# Altium schematic sheet Power.SchDoc
size C; SheetNumber: 3; SheetTotal: 6
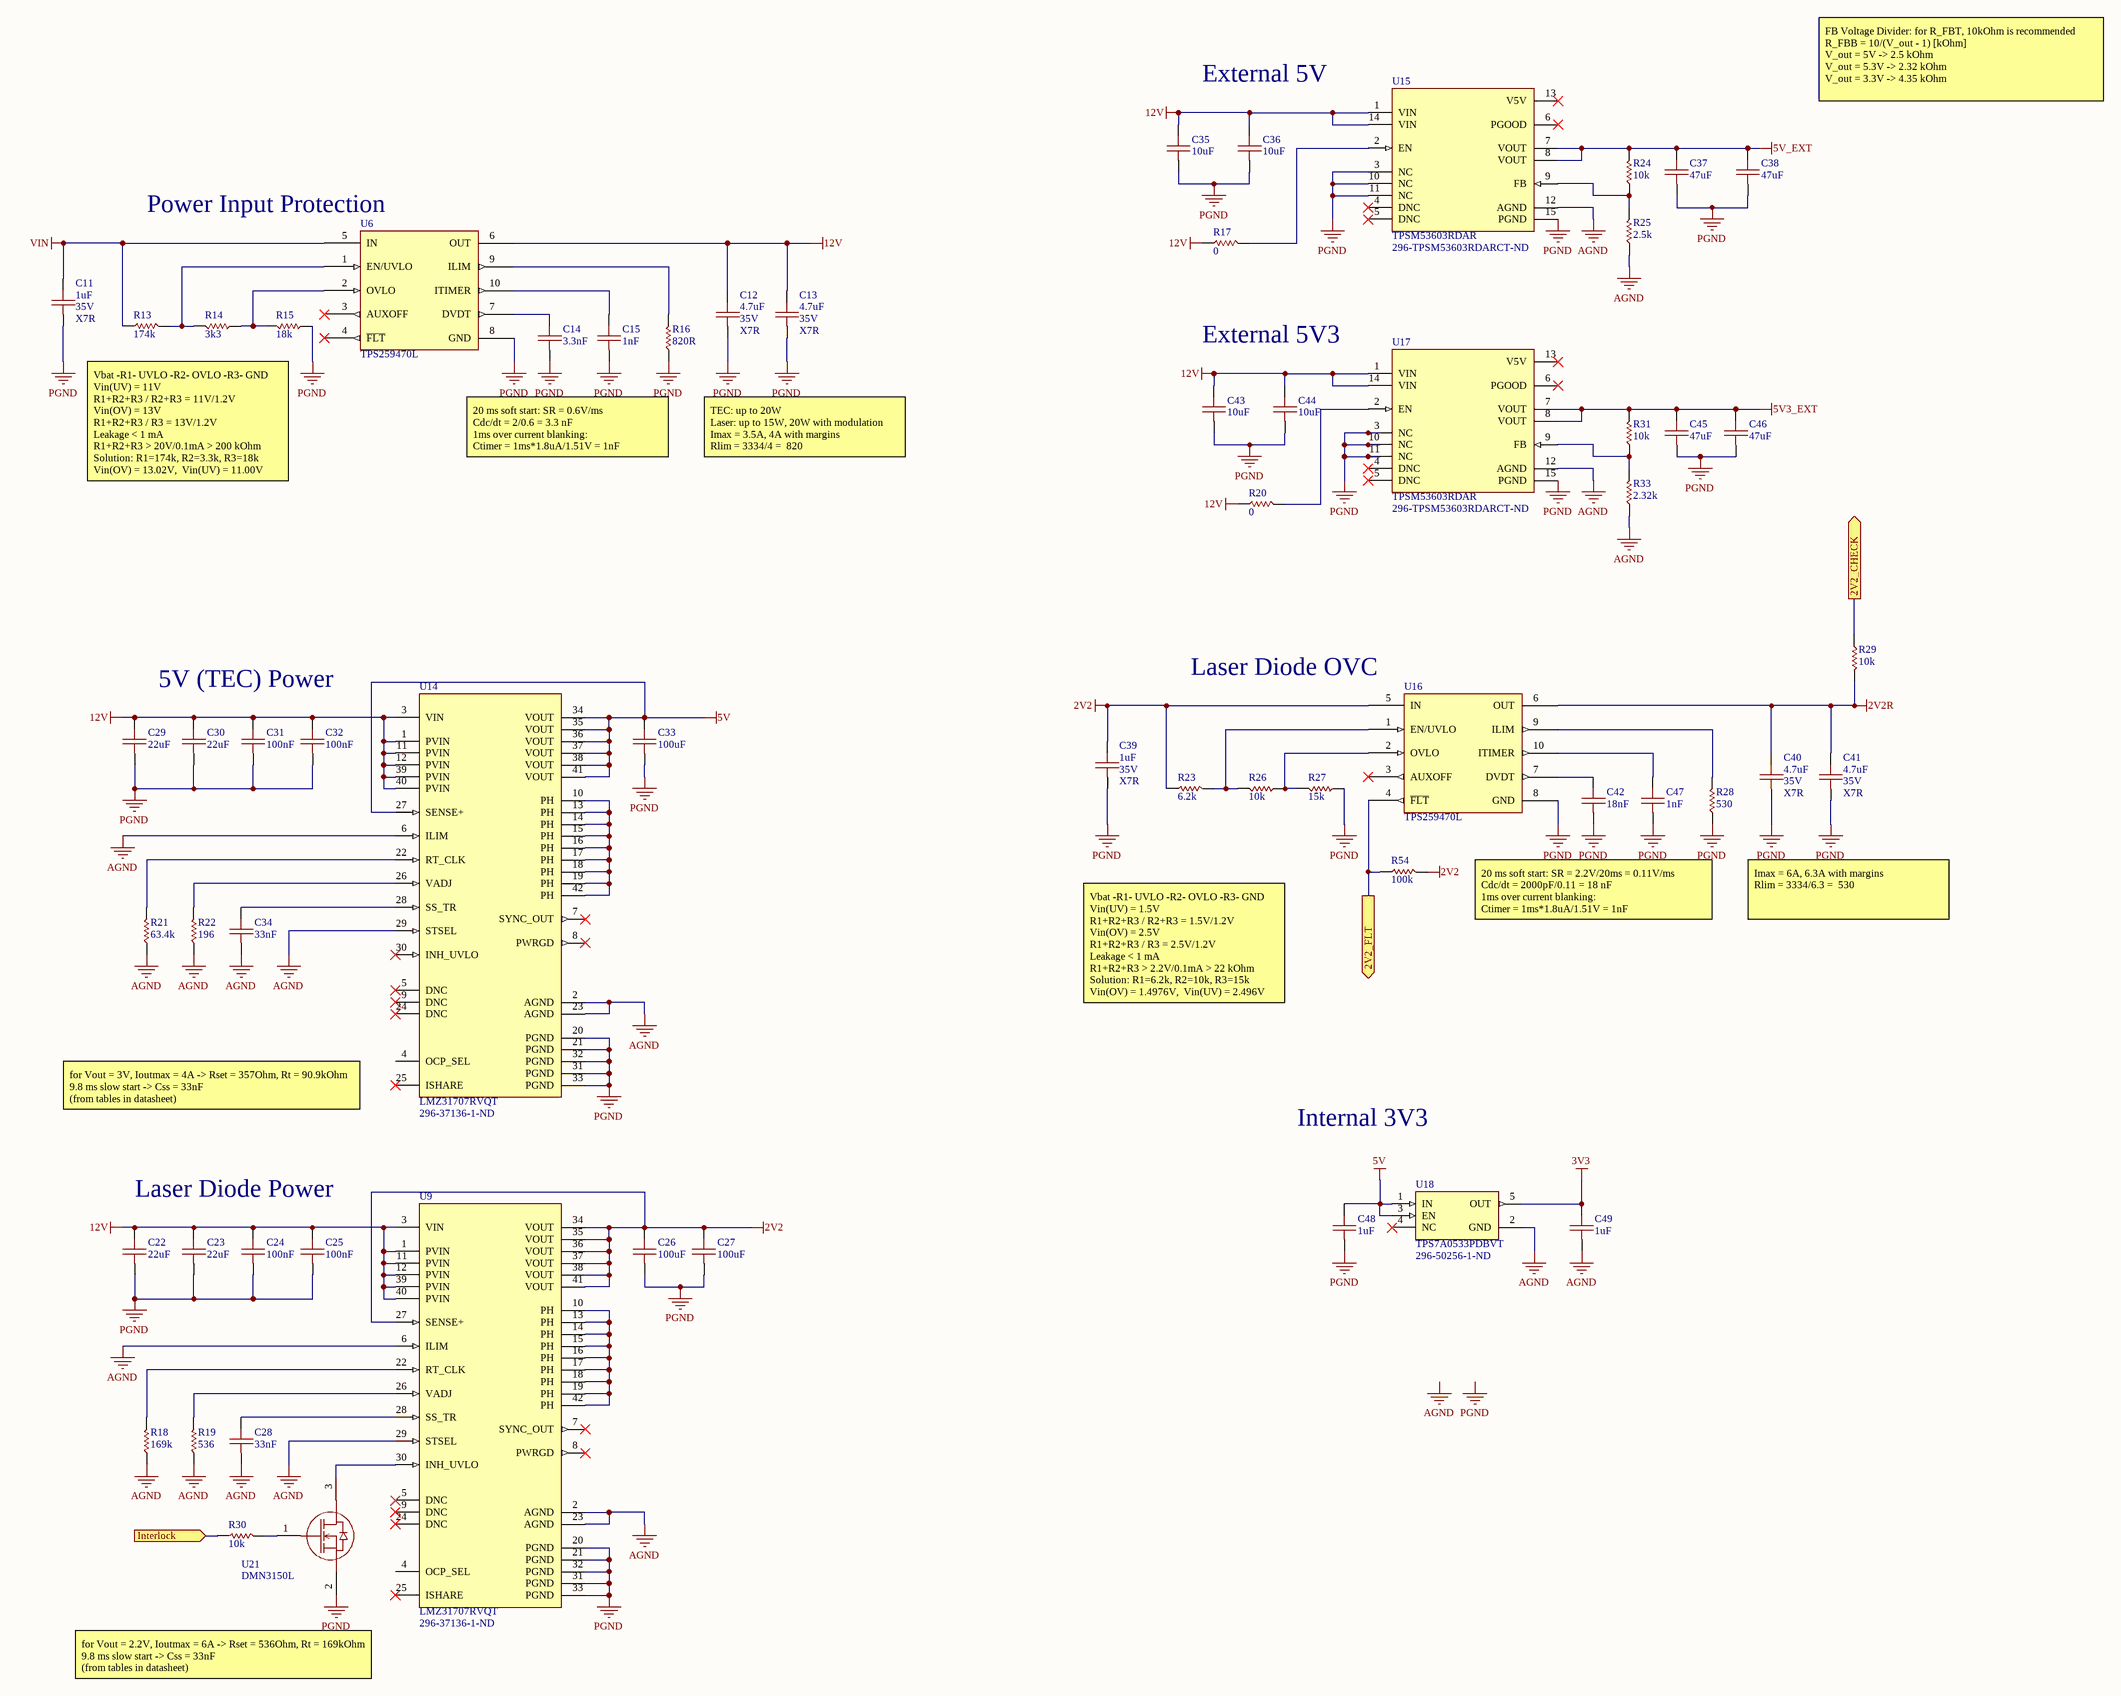
[diagram p0: Power.SchDoc]

## Parts
C11  1uF  Voltage: 35V  Type: X7R  [0805 B]
C12  4.7uF  Voltage: 35V  Type: X7R  [0805 B]
C13  4.7uF  Voltage: 35V  Type: X7R  [0805 B]
C14  3.3nF  [0603 B]
C15  1nF  [0603 B]
C22  22uF  [1210]
C23  22uF  [1210]
C24  100nF  [0603 B]
C25  100nF  [0603 B]
C26  100uF  [1206 B]
C27  100uF  [1206 B]
C28  33nF  [0603 B]
C29  22uF  [1210]
C30  22uF  [1210]
C31  100nF  [0603 B]
C32  100nF  [0603 B]
C33  100uF  [1206 B]
C34  33nF  [0603 B]
C35  10uF  [0603 B]
C36  10uF  [0603 B]
C37  47uF  [0603 B]
C38  47uF  [0603 B]
C39  1uF  Voltage: 35V  Type: X7R  [0805 B]
C40  4.7uF  Voltage: 35V  Type: X7R  [0805 B]
C41  4.7uF  Voltage: 35V  Type: X7R  [0805 B]
C42  18nF  [0603 B]
C43  10uF  [0603 B]
C44  10uF  [0603 B]
C45  47uF  [0603 B]
C46  47uF  [0603 B]
C47  1nF  [0603 B]
C48  1uF  [0603 B]
C49  1uF  [0603 B]
R13  174k  [0603]
R14  3k3  [0603]
R15  18k  [0603]
R16  820R  [0603]
R17  0  [0603]
R18  169k  [0805]
R19  536  [0805]
R20  0  [0603]
R21  63.4k  [0805]
R22  196  [0805]
R23  6.2k  [0603]
R24  10k  [0805]
R25  2.5k  [0805]
R26  10k  [0603]
R27  15k  [0603]
R28  530  [0603]
R29  10k  [0603]
R30  10k  [0603]
R31  10k  [0805]
R33  2.32k  [0805]
R54  100k  [0603]
U6  TPS259470L  [VQFN-HR 2x2]
U9  LMZ31707RVQT  Supplier Part Number 1: 296-37136-1-ND  [PB3QFN]
U14  LMZ31707RVQT  Supplier Part Number 1: 296-37136-1-ND  [PB3QFN]
U15  TPSM53603RDAR  Supplier Part Number 1: 296-TPSM53603RDARCT-ND  [RDA0015A]
U16  TPS259470L  [VQFN-HR 2x2]
U17  TPSM53603RDAR  Supplier Part Number 1: 296-TPSM53603RDARCT-ND  [RDA0015A]
U18  TPS7A0533PDBVT  Supplier Part Number 1: 296-50256-1-ND  [DBV0005A-MFG]
U21  DMN3150L  [SOT-23]

## Ports
2V2_CHECK (out), 2V2_FLT (out), Interlock (in)

## Nets
2V2: C26.2 C27.2 C39.2 R23.2 R54.1 U9.27(SENSE+) U9.34(VOUT) U9.35(VOUT) U9.36(VOUT) U9.37(VOUT) U9.38(VOUT) U9.41(VOUT) U16.5(IN)
2V2R: C40.2 C41.2 R29.1 U16.6(OUT)
3V3: C49.2 U18.5(OUT)
5V: C33.2 C48.2 U14.27(SENSE+) U14.34(VOUT) U14.35(VOUT) U14.36(VOUT) U14.37(VOUT) U14.38(VOUT) U14.41(VOUT) U18.1(IN) U18.3(EN)
5V3_EXT: C45.2 C46.2 R31.1 U17.7(VOUT) U17.8(VOUT)
5V_EXT: C37.2 C38.2 R24.1 U15.7(VOUT) U15.8(VOUT)
12V: C12.2 C13.2 C22.2 C23.2 C24.2 C25.2 C29.2 C30.2 C31.2 C32.2 C35.2 C36.2 C43.2 C44.2 R17.2 R20.2 U6.6(OUT) U9.1(PVIN) U9.3(VIN) U9.11(PVIN) U9.12(PVIN) U9.39(PVIN) U9.40(PVIN) U14.1(PVIN) U14.3(VIN) U14.11(PVIN) U14.12(PVIN) U14.39(PVIN) U14.40(PVIN) U15.1(VIN) U15.14(VIN) U17.1(VIN) U17.14(VIN)
AGND: C28.1 C34.1 C49.1 R18.2 R19.2 R21.2 R22.2 R25.2 R33.2 U9.2(AGND) U9.6(ILIM) U9.23(AGND) U9.29(STSEL) U14.2(AGND) U14.6(ILIM) U14.23(AGND) U14.29(STSEL) U15.12(AGND) U17.12(AGND) U18.2(GND)
PGND: C11.1 C12.1 C13.1 C14.1 C15.1 C22.1 C23.1 C24.1 C25.1 C26.1 C27.1 C29.1 C30.1 C31.1 C32.1 C33.1 C35.1 C36.1 C37.1 C38.1 C39.1 C40.1 C41.1 C42.1 C43.1 C44.1 C45.1 C46.1 C47.1 C48.1 R15.2 R16.2 R27.2 R28.2 U6.8(GND) U9.20(PGND) U9.21(PGND) U9.31(PGND) U9.32(PGND) U9.33(PGND) U14.20(PGND) U14.21(PGND) U14.31(PGND) U14.32(PGND) U14.33(PGND) U15.3(NC) U15.10(NC) U15.11(NC) U15.15(PGND) U16.8(GND) U17.3(NC) U17.10(NC) U17.11(NC) U17.15(PGND) U21.2(S)
VIN: C11.2 R13.2 U6.5(IN)
2V2_CHECK: R29.2 ; port 2V2_CHECK
2V2_FLT: R54.2 U16.4(~{FLT}) ; port 2V2_FLT
Interlock: R30.2 ; port Interlock
NetC14_2: C14.2 U6.7(DVDT)
NetC15_2: C15.2 U6.10(ITIMER)
NetC28_2: C28.2 U9.28(SS_TR)
NetC34_2: C34.2 U14.28(SS_TR)
NetC42_2: C42.2 U16.7(DVDT)
NetC47_2: C47.2 U16.10(ITIMER)
NetR13_1: R13.1 R14.1 U6.1(EN/UVLO)
NetR14_2: R14.2 R15.1 U6.2(OVLO)
NetR16_1: R16.1 U6.9(ILIM)
NetR17_1: R17.1 U15.2(EN)
NetR18_1: R18.1 U9.22(RT_CLK)
NetR19_1: R19.1 U9.26(VADJ)
NetR20_1: R20.1 U17.2(EN)
NetR21_1: R21.1 U14.22(RT_CLK)
NetR22_1: R22.1 U14.26(VADJ)
NetR23_1: R23.1 R26.1 U16.1(EN/UVLO)
NetR24_2: R24.2 R25.1 U15.9(FB)
NetR26_2: R26.2 R27.1 U16.2(OVLO)
NetR28_1: R28.1 U16.9(ILIM)
NetR30_1: R30.1 U21.1(G)
NetR31_2: R31.2 R33.1 U17.9(FB)
NetU9_10: U9.10(PH) U9.13(PH) U9.14(PH) U9.15(PH) U9.16(PH) U9.17(PH) U9.18(PH) U9.19(PH) U9.42(PH)
NetU9_30: U9.30(INH_UVLO) U21.3(D)
NetU14_10: U14.10(PH) U14.13(PH) U14.14(PH) U14.15(PH) U14.16(PH) U14.17(PH) U14.18(PH) U14.19(PH) U14.42(PH)

Not connected (* = marked no-connect by the designer): U6 3(AUXOFF)* 4(~{FLT})*; U9 4(OCP_SEL) 5(DNC)* 7(SYNC_OUT)* 8(PWRGD)* 9(DNC)* 24(DNC)* 25(ISHARE)*; U14 4(OCP_SEL) 5(DNC)* 7(SYNC_OUT)* 8(PWRGD)* 9(DNC)* 24(DNC)* 25(ISHARE)* 30(INH_UVLO)*; U15 4(DNC)* 5(DNC)* 6(PGOOD)* 13(V5V)*; U16 3(AUXOFF)*; U17 4(DNC)* 5(DNC)* 6(PGOOD)* 13(V5V)*; U18 4(NC)*

## Notes on the sheet
- External 5V
- FB Voltage Divider: for R_FBT, 10kOhm is recommended
  R_FBB = 10/(V_out - 1) [kOhm]
  V_out = 5V -> 2.5 kOhm
  V_out = 5.3V -> 2.32 kOhm
  V_out = 3.3V -> 4.35 kOhm
- (near U6) Power Input Protection
- External 5V3
- Vbat -R1- UVLO -R2- OVLO -R3- GND
  Vin(UV) = 11V
  R1+R2+R3 / R2+R3 = 11V/1.2V
  Vin(OV) = 13V
  R1+R2+R3 / R3 = 13V/1.2V
  Leakage < 1 mA
  R1+R2+R3 > 20V/0.1mA > 200 kOhm
  Solution: R1=174k, R2=3.3k, R3=18k
  Vin(OV) = 13.02V,  Vin(UV) = 11.00V
- 20 ms soft start: SR = 0.6V/ms
  Cdc/dt = 2/0.6 = 3.3 nF
  1ms over current blanking:
  Ctimer = 1ms*1.8uA/1.51V = 1nF
- TEC: up to 20W
  Laser: up to 15W, 20W with modulation
  Imax = 3.5A, 4A with margins
  Rlim = 3334/4 =  820
- (near U16) Laser Diode OVC
- 5V (TEC) Power
- 20 ms soft start: SR = 2.2V/20ms = 0.11V/ms
  Cdc/dt = 2000pF/0.11 = 18 nF
  1ms over current blanking:
  Ctimer = 1ms*1.8uA/1.51V = 1nF
- Imax = 6A, 6.3A with margins
  Rlim = 3334/6.3 =  530
- Vbat -R1- UVLO -R2- OVLO -R3- GND
  Vin(UV) = 1.5V
  R1+R2+R3 / R2+R3 = 1.5V/1.2V
  Vin(OV) = 2.5V
  R1+R2+R3 / R3 = 2.5V/1.2V
  Leakage < 1 mA
  R1+R2+R3 > 2.2V/0.1mA > 22 kOhm
  Solution: R1=6.2k, R2=10k, R3=15k
  Vin(OV) = 1.4976V,  Vin(UV) = 2.496V
- for Vout = 3V, Ioutmax = 4A -> Rset = 357Ohm, Rt = 90.9kOhm
  9.8 ms slow start -> Css = 33nF
  (from tables in datasheet)
- Internal 3V3
- Laser Diode Power
- for Vout = 2.2V, Ioutmax = 6A -> Rset = 536Ohm, Rt = 169kOhm
  9.8 ms slow start -> Css = 33nF
  (from tables in datasheet)
- Labels drawn without touching a wire or pin: AGND, PGND

## Library data of the parts
C11-C13 C39-C41 = CAP 0805: 805 Capacitor
  C11 C39: Value: 1uF
  C12 C13 C40 C41: Value: 4.7uF
C14 C15 C24 C25 C28 C31 C32 C34-C38 C42-C49 = CAP 0603: 603 Capacitor
  C14: Value: 3.3nF
  C15 C47: Value: 1nF
  C24 C25 C31 C32: Value: 100nF
  C28 C34: Value: 33nF
  C35 C36 C43 C44: Value: 10uF
  C37 C38 C45 C46: Value: 47uF
  C42: Value: 18nF
  C48 C49: Value: 1uF
C22 C23 C29 C30 = CAP 1210: 1210 Capacitor; Value: 22uF
C26 C27 C33 = CAP 1206: 1206 Capacitor; Value: 100uF
R13-R17 R20 R23 R26-R30 R54 = RES 0603: 603 Resistor
  R13: Value: 174k
  R14: Value: 3k3
  R15: Value: 18k
  R16: Value: 820R
  R17 R20: Value: 0
  R23: Value: 6.2k
  R26 R29 R30: Value: 10k
  R27: Value: 15k
  R28: Value: 530
  R54: Value: 100k
R18 R19 R21 R22 R24 R25 R31 R33 = RES 0805: 805 Resistor
  R18: Value: 169k
  R19: Value: 536
  R21: Value: 63.4k
  R22: Value: 196
  R24 R31: Value: 10k
  R25: Value: 2.5k
  R33: Value: 2.32k
U6 U16 = TPS259470L: 2.7-23 V, 5.5 A, 28 mΩ True Reverse Current Blocking eFuse with Input Reverse Polarity Protection; Ref: TPS259470L
U9 U14 = LMZ31707RVQT: Non-Isolated DC/DC Converters 7A Power Module w/ 2.95V-17V Input; PartNumber: LMZ31707RVQR; Manufacturer: Texas Instruments; RefDes: RefDes; Type: DEV; Value: Value; Copyright: Copyright (C) 2018 Accelerated Designs. All rights reserved; Supplier 1: Digi-Key
U15 U17 = TPSM53603RDAR: 36-V, 3-A step-down power module in small 5.5 x 5 x 4-mm Enhanced HotRod™ QFN with simple footprint; Manufacturer: Texas Instruments; PartNumber: TPSM53603RDAR; RefDes: RefDes; Type: DEV; Value: Value; Copyright: Copyright (C) 2018 Accelerated Designs. All rights reserved; Supplier 1: Digi-Key
U18 = TPS7A0533PDBVT: Linear Voltage Regulator IC Positive Fixed 1 Output 200mA SOT-23-5; PartNumber: TPS7A2050PDBVR; Manufacturer: Texas Instruments; RefDes: RefDes; Type: DEV; Value: Value; Copyright: Copyright (C) 2021 Accelerated Designs. All rights reserved; Supplier 1: Digi-Key
U21 = DMN3150L: Power-Transistor; Ref: DMN3150L